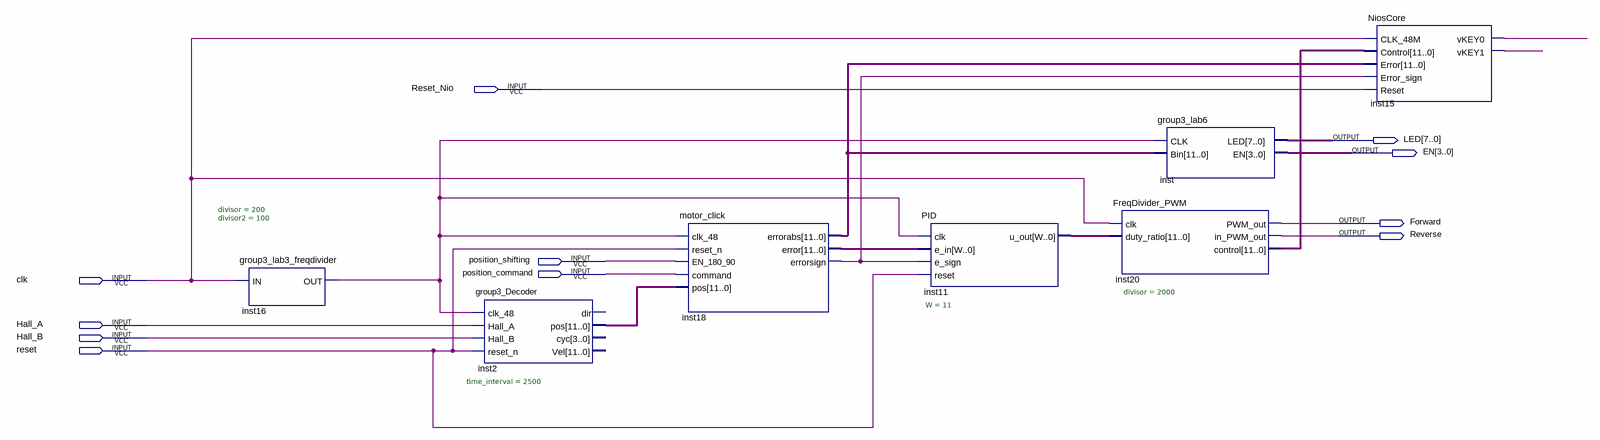
[diagram p0: schematic sheet]
// Quartus schematic group3_final_project.bdf as structural Verilog: 7 symbols, 11 pins
module group3_final_project (
  input  Reset_Nio,
  input  position_shifting,
  input  position_command,
  input  clk,
  input  Hall_A,
  input  Hall_B,
  input  reset,
  output [7:0] LED,
  output [3:0] EN,
  output Forward,
  output Reverse
);

  wire inst15_vkey0, inst15_vkey1, inst16_out, inst18_errorsign;
  wire [11:0] inst2_pos, inst11_u_out, inst18_error, inst18_errorabs, inst20_control;

  group3_lab3_freqdivider #(.divisor(200), .divisor2(100)) inst16 (.IN(clk), .OUT(inst16_out));
  group3_Decoder #(.time_interval(2500)) inst2 (
    .clk_48(inst16_out), .Hall_A(Hall_A), .Hall_B(Hall_B), .reset_n(reset), .pos(inst2_pos));  // open: dir, cyc, Vel
  motor_click inst18 (
    .clk_48(inst16_out), .reset_n(reset), .EN_180_90(position_shifting), .command(position_command),
    .pos(inst2_pos), .errorabs(inst18_errorabs), .error(inst18_error), .errorsign(inst18_errorsign));
  PID #(.W(11)) inst11 (
    .clk(inst16_out), .e_in(inst18_error), .e_sign(inst18_errorsign), .reset(reset), .u_out(inst11_u_out));
  FreqDivider_PWM #(.divisor(2000)) inst20 (
    .clk(clk), .duty_ratio(inst11_u_out), .PWM_out(Forward), .in_PWM_out(Reverse), .control(inst20_control));
  group3_lab6 inst (.CLK(inst16_out), .Bin(inst18_errorabs), .LED(LED), .EN(EN));
  NiosCore inst15 (
    .CLK_48M(clk), .Control(inst20_control), .Error(inst18_errorabs), .Error_sign(inst18_errorsign),
    .Reset(Reset_Nio), .vKEY0(inst15_vkey0), .vKEY1(inst15_vkey1));
endmodule
